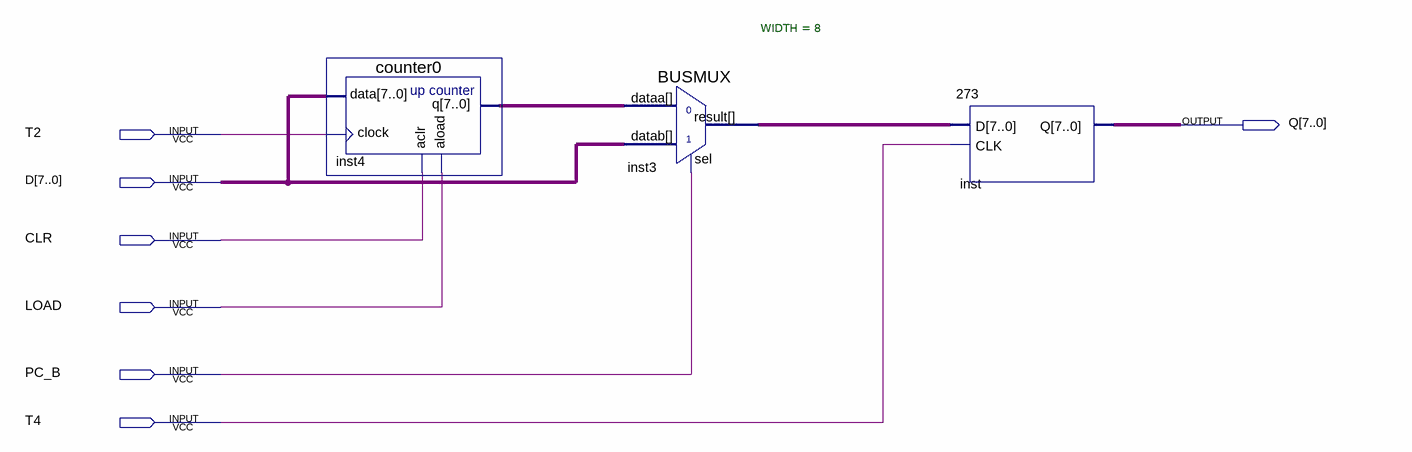
[diagram p0: schematic sheet]
// Quartus schematic PC_AR.bdf as structural Verilog: 3 symbols, 7 pins
module PC_AR (
  input  T2,
  input  [7:0] D,
  input  CLR,
  input  LOAD,
  input  PC_B,
  input  T4,
  output [7:0] Q
);

  wire [7:0] inst3_result, inst4_q;

  counter0 inst4 (.data(D), .clock(T2), .aclr(CLR), .aload(LOAD), .q(inst4_q));
  BUSMUX #(.WIDTH(8)) inst3 (.datab(D), .sel(PC_B), .dataa(inst4_q), .result(inst3_result));
  \273  inst (.D(inst3_result), .CLK(T4), .Q(Q));
endmodule
